# EAGLE schematic Circuit Diagram (EAGLE 9.2.2)
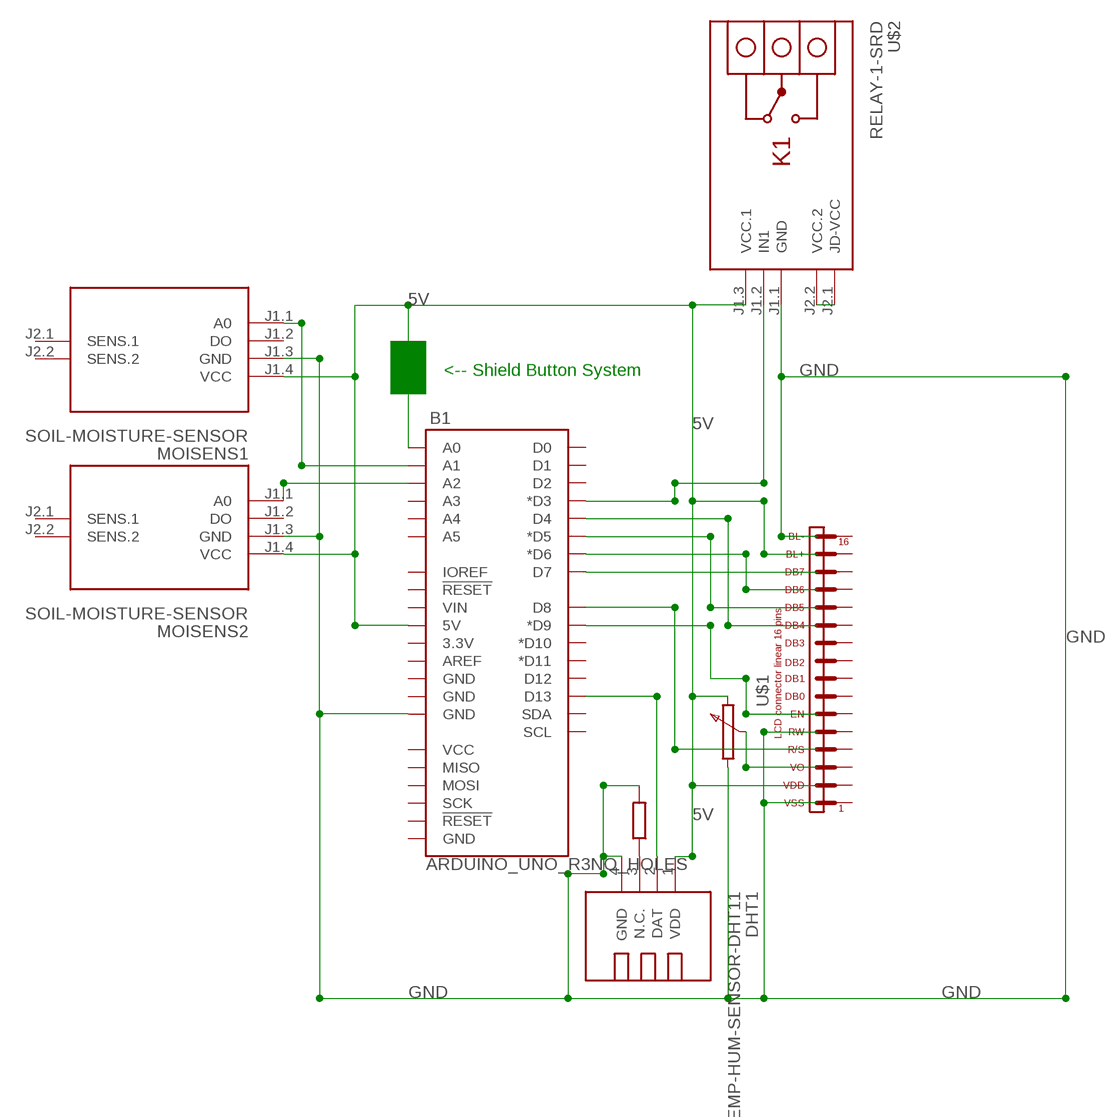
[diagram p0: schematic, sheet 1]

## Parts
B1  ARDUINO_UNO_R3NO_HOLES  [ARDUINO_R3_NO_HOLES]
DHT1  TEMP-HUM-SENSOR-DHT11  [TEMP-HUM-SENSOR-DHT11]
MOISENS1  SOIL-MOISTURE-SENSOR  [SOIL-MOISTURE-SENSOR]
MOISENS2  SOIL-MOISTURE-SENSOR  [SOIL-MOISTURE-SENSOR]
U$1  -LCD2X16  [CON8X2LCD]
U$2  RELAY-1-SRD  [RELAY-1-SRD]

## Nets
5V: B1.5V B1.A0 DHT1.1(VDD) MOISENS1.J1.4(VCC) MOISENS2.J1.4(VCC) U$2.J1.3(VCC.1)
GND: B1.GND@2(GND) DHT1.4(GND) MOISENS1.J1.3(GND) MOISENS2.J1.3(GND) U$2.J1.1(GND)
N$1: B1.D9(*D9)
N$2: B1.A2 MOISENS2.J1.1(A0)
N$3: B1.D4
N$5: B1.A1 MOISENS1.J1.1(A0)
N$6: B1.D8
N$7: B1.D5(*D5)
N$8: B1.D6(*D6)
N$9: B1.D7
N$10: U$2.J2.1(JD-VCC) U$2.J2.2(VCC.2)
N$11: B1.D13 DHT1.2(DAT)
N$12: B1.D3(*D3) U$2.J1.2(IN1)
Unconnected: B1.3.3V B1.A3 B1.A4 B1.A5 B1.AREF B1.D0 B1.D1 B1.D2 B1.D10(*D10) B1.D11(*D11) B1.D12 B1.GND@1(GND) B1.GND@3(GND) B1.GND@4(GND) B1.IOREF B1.MISO B1.MOSI B1.RESET@1(!RESET!) B1.RESET@2(!RESET!) B1.SCK B1.SCL B1.SDA B1.VCC B1.VIN DHT1.3(N.C.) MOISENS1.J1.2(DO) MOISENS1.J2.1(SENS.1) MOISENS1.J2.2(SENS.2) MOISENS2.J1.2(DO) MOISENS2.J2.1(SENS.1) MOISENS2.J2.2(SENS.2) U$1.P$1(VSS) U$1.P$2(VDD) U$1.P$3(V0) U$1.P$4(RW) U$1.P$5(R/S) U$1.P$6(EN) U$1.P$7(DB0) U$1.P$8(DB1) U$1.P$9(DB2) U$1.P$10(DB3) U$1.P$11(DB4) U$1.P$12(DB5) U$1.P$13(DB6) U$1.P$14(DB7) U$1.P$15(BKL+) U$1.P$16(BKL-)

## Notes on the sheet
- <-- Shield Button System

## Library data of the parts
B1 = SparkFun-Boards:ARDUINO_UNO_R3: Arduino R3 Footprint with SPI header Arduino Uno R3 Compatible Footprint. Matches PCB size of the original board. SparkFun Products: SAMD21 Dev Breakout <https://www.sparkfun.com/products/13672> RedBoard <https://www.sparkfun.com/products/12757> R3 Stackable Headers <https://www.sparkfun.com/products/11417>
DHT1 = diy-modules (1):TEMP-HUM-SENSOR-DHT11: DHT11 - digital humidity & temperature sensor DHT11 datasheet available here: https://akizukidenshi.com/download/ds/aosong/DHT11.pdf Click here to find device on ebay.com <http://www.ebay.com/sch/dht11+digital+sensor>
MOISENS1 MOISENS2 = diy-modules (1):SOIL-MOISTURE-SENSOR: Soil Moisture Sensor Click here to find device on ebay.com <http://www.ebay.com/sch/soil+moisture+sensor+arduino>
U$1 = tango:-LCD2X16
U$2 = diy-modules (1):RELAY-1-SRD: 1-Channel Relay Module based on SRD-05VDC-SL-C relays Click here to find device on ebay.com <http://www.ebay.com/sch/one+channel+isolated+relay+5v>